# Altium schematic sheet P04_USB_hub.SchDoc
size A4
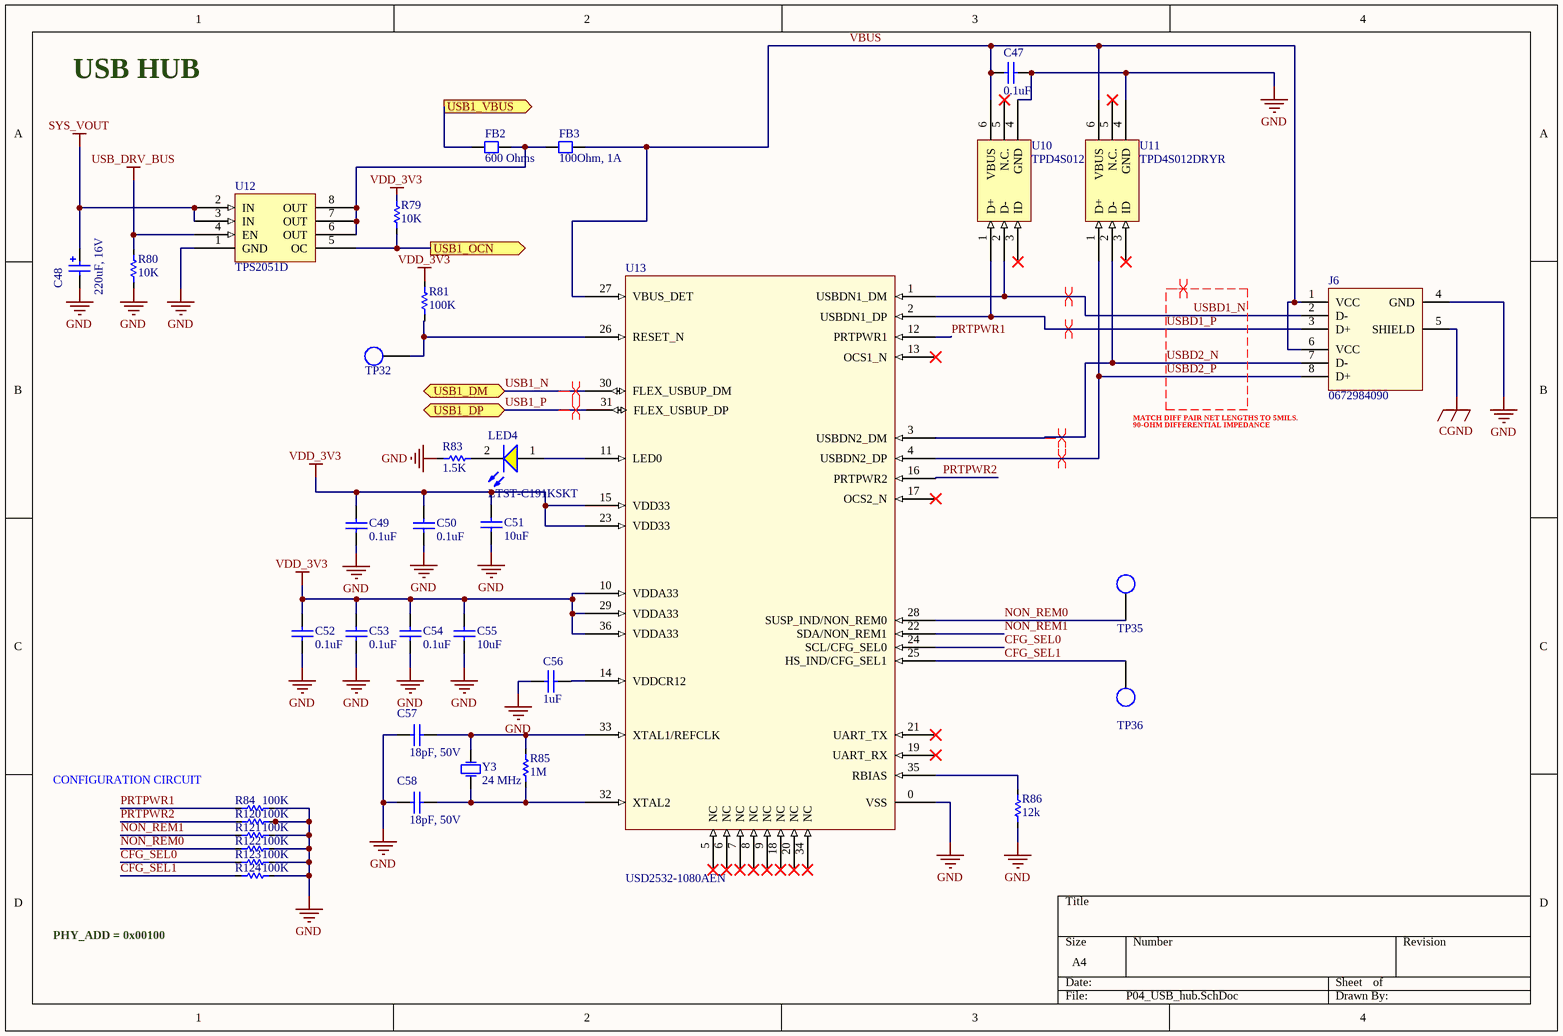
[diagram p0: P04_USB_hub.SchDoc]

## Parts
C47  0.1uF  [CAP_0603]
C48  220uF, 16V  [CAP_SMD_6.3x7.7]
C49  0.1uF  [CAP_0603]
C50  0.1uF  [CAP_0603]
C51  10uF  [CAP_0603]
C52  0.1uF  [CAP_0603]
C53  0.1uF  [CAP_0603]
C54  0.1uF  [CAP_0603]
C55  10uF  [CAP_0603]
C56  1uF  [CAP_0603]
C57  18pF, 50V  [CAP_0603]
C58  18pF, 50V  [CAP_0603]
FB2  600 Ohms  [CAP_0603]
FB3  100Ohm, 1A  [CAP_0603]
J6  0672984090  [Dual USB Connector Molex]
LED4  LTST-C191KSKT  [LED_0603]
R79  10K  [RES_0603]
R80  10K  [RES_0603]
R81  100K  [RES_0603]
R83  1.5K  [RES_0603]
R84  100K  [RES_0603]
R85  1M  [RES_0603]
R86  12k  [RES_0603]
R120  100K  [RES_0603]
R121  100K  [RES_0603]
R122  100K  [RES_0603]
R123  100K  [RES_0603]
R124  100K  [RES_0603]
TP32  TP_SMD  [TP_SMD]  (value not drawn)
TP35  TP_SMD  [TP_SMD]  (value not drawn)
TP36  TP_SMD  [TP_SMD]  (value not drawn)
U10  TPD4S012DRYR  [SON50P100X60-6N]
U11  TPD4S012DRYR  [SON50P100X60-6N]
U12  TPS2051D  [SOIC127P600X175-8N]
U13  USD2532-1080AEN  [DUAL_USB_HUB]
Y3  24 MHz  [7A-24MHz]

## Ports
USB1_DM (bidir), USB1_DP (bidir), USB1_OCN (out), USB1_VBUS (out)

## Nets
CGND: J6.5(SHIELD)
GND: C47.2 C48.1(N) C49.1 C50.1 C51.1 C52.1 C53.1 C54.1 C55.1 C56.1 C57.1(N) C58.1(N) J6.4(GND) R80.1 R83.1 R84.2 R86.1 R120.2 R121.2 R122.2 R123.2 R124.2 U10.4(GND) U11.4(GND) U12.1(GND) U13.0(VSS)
SYS_VOUT: C48.2(P) U12.2(IN) U12.3(IN)
USB_DRV_BUS: R80.2 U12.4(EN)
VDD_3V3: C49.2 C50.2 C51.2 C52.2 C53.2 C54.2 C55.2 R79.2 R81.2 U13.10(VDDA33) U13.15(VDD33) U13.23(VDD33) U13.29(VDDA33) U13.36(VDDA33)
CFG_SEL0: R123.1 U13.24(SCL/CFG_SEL0)
CFG_SEL1: R124.1 TP36.1 U13.25(HS_IND/CFG_SEL1)
NON_REM0: R122.1 TP35.1 U13.28(SUSP_IND/NON_REM0)
NON_REM1: R121.1 U13.22(SDA/NON_REM1)
PRTPWR1: R84.1 U13.12(PRTPWR1)
PRTPWR2: R120.1 U13.16(PRTPWR2)
USB1_N: U13.30(FLEX_USBUP_DM) ; port USB1_DM
USB1_OCN: R79.1 U12.5(OC) ; port USB1_OCN
USB1_P: U13.31(FLEX_USBUP_DP) ; port USB1_DP
USB1_VBUS: FB2.1 ; port USB1_VBUS
USBD1_N: J6.2(D-) U10.2(D-) U13.1(USBDN1_DM)
USBD1_P: J6.3(D+) U10.1(D+) U13.2(USBDN1_DP)
USBD2_N: J6.7(D-) U11.2(D-) U13.3(USBDN2_DM)
USBD2_P: J6.8(D+) U11.1(D+) U13.4(USBDN2_DP)
VBUS: C47.1 FB3.2 J6.1(VCC) J6.6(VCC) U10.6(VBUS) U11.6(VBUS) U13.27(VBUS_DET)
NetC56_2: C56.2 U13.14(VDDCR12)
NetC57_2: C57.2(P) R85.2 U13.33(XTAL1/REFCLK) Y3.2(OSC2)
NetC58_2: C58.2(P) R85.1 U13.32(XTAL2) Y3.1(OSC1)
NetFB2_2: FB2.2 FB3.1 U12.6(OUT) U12.7(OUT) U12.8(OUT)
NetLED4_1: LED4.1(A) U13.11(LED0)
NetLED4_2: LED4.2(C) R83.2
NetR81_1: R81.1 TP32.1 U13.26(RESET_N)
NetR86_2: R86.2 U13.35(RBIAS)

Not connected (* = marked no-connect by the designer): U10 3(ID)* 5(N.C.)*; U11 3(ID)* 5(N.C.)*; U13 5(NC)* 6(NC)* 7(NC)* 8(NC)* 9(NC)* 13(OCS1_N)* 17(OCS2_N)* 18(NC)* 19(UART_RX)* 20(NC)* 21(UART_TX)* 34(NC)*

## Layout directives
differential pair; net class Z90_DIFF: USBD1_N, USBD1_P, USBD2_N, USBD2_P
differential pair: USBD1_N, USBD1_P, USBD2_N, USBD2_P
differential pair; differential pair class USB: USB1_N, USB1_P

## Notes on the sheet
- USB HUB
- MATCH DIFF PAIR NET LENGTHS TO 5MILS.
- 90-OHM DIFFERENTIAL IMPEDANCE
- CONFIGURATION CIRCUIT
- PHY_ADD = 0x00100

## Library data of the parts
C47 C49 C50 C52-C54 = C0603C104M4RACTU: CAP CER 0.1UF 16V X7R 0603; Manufacturer: KEMET; Tolerance: 20%; ComponentLink1Description: Manufacturer; ComponentLink1URL: http://www.we-online.de; Value: 0.1uF; Rated Voltage: 16V; Ceramic Type: X7R; Supplier Part No.: 399-1099-1-ND; Package Reference: CAP_0603; Package Description: 0603; Mounting Technology: SMD; Manufacturer Part No.: C0603C104M4RACTU; Datasheet: https://content.kemet.com/datasheets/KEM_C1002_X7R_SMD.pdf; Supplier: Digi-Key; ComponentLink2Description: Datasheet; ComponentLink2URL: https://content.kemet.com/datasheets/KEM_C1002_X7R_SMD.pdf
C48 = 865080345012: CAP 220 UF 20% 16 V; Manufacturer: Wurth Elektronik; Rated Voltage: 16 VDC; ComponentLink1Description: Manufacturer; ComponentLink1URL: http://www.we-online.de; ComponentLink2Description: Datasheet; ComponentLink2URL: https://katalog.we-online.com/pbs/datasheet/865080345012.pdf; Mounting Technology: SMD; Value: 220uF; Manufacturer Part No.: 865080345012; Tolerance: 20%; Datasheet: *; Supplier: Digi-Key; Package Reference: CAP_SMD_6.3x7.7; Supplier Part No.: 732-8422-1-ND; Package Description: CAP_SMD_6.3x7.7
C51 C55 = C0603C106M8PAC7867: CAP CER 10UF 10V X5R 0603; Manufacturer: KEMET; Ceramic Type: X7R; Tolerance: 20%; ComponentLink1Description: Manufacturer; ComponentLink1URL: http://www.we-online.de; Value: 10uF; Rated Voltage: 10V; Supplier Part No.: 399-14945-1-ND; Package Reference: CAP_0603; Package Description: 0603; Mounting Technology: SMD; Manufacturer Part No.: C0603C106M8PAC7867; Datasheet: https://content.kemet.com/datasheets/KEM_C1002_X7R_SMD.pdf; Supplier: Digi-Key; ComponentLink2Description: Datasheet; ComponentLink2URL: https://content.kemet.com/datasheets/KEM_C1002_X7R_SMD.pdf
C56 = C0603C105M4RACTU: CAP CER 1UF 16V X7R 0603; Manufacturer: KEMET; Tolerance: 20%; ComponentLink1Description: Manufacturer; ComponentLink1URL: http://www.we-online.de; Value: 1uF; Rated Voltage: 16V; Ceramic Type: X7R; Supplier Part No.: 399-11136-1-ND; Package Reference: CAP_0603; Package Description: 0603; Mounting Technology: SMD; Manufacturer Part No.: C0603C105M4RACTU; Datasheet: https://content.kemet.com/datasheets/KEM_C1002_X7R_SMD.pdf; Supplier: Digi-Key; ComponentLink2Description: Datasheet; ComponentLink2URL: https://content.kemet.com/datasheets/KEM_C1002_X7R_SMD.pdf
C57 C58 = C0603C180D5GACTU: CAP CER 18PF 50V C0G/NP0 0603 +/- 0.5 PF; Manufacturer: KEMET; Tolerance: 0.5 pF; Rated Voltage: 50 VDC; ComponentLink1Description: Manufacturer; ComponentLink1URL: http://www.we-online.de; ComponentLink2Description: Datasheet; ComponentLink2URL: https://katalog.we-online.com/pbs/datasheet/865080345012.pdf; Mounting Technology: SMD; Value: 18 pF; Manufacturer Part No.: C0603C180D5GACTU; Datasheet: *; Supplier: Digi-Key; Package Reference: CAP_0603; Supplier Part No.: 399-9018-1-ND; Package Description: 0603
FB2 = BBHV00160808601Y00: 600 Ohms @ 100MHz Ferrite Bead 0603 2A 100mOhm; Manufacturer: Chilisin Electronics; ComponentLink1Description: Manufacturer; ComponentLink1URL: http://www.we-online.de; Value: 600 Ohms; Rated Current: 2 A; Supplier Part No.: 2184-BBHV00160808601Y00CT-ND; Package Reference: FB_0603; Package Description: 0603; Mounting Technology: SMD; Manufacturer Part No.: BBHV00160808601Y00; Datasheet: https://www.chilisin.com/upload/media/product/emi_bead/file/BBHV_Series.pdf; Tolerance: -; Supplier: Digi-Key; ComponentLink2Description: Datasheet; ComponentLink2URL: https://content.kemet.com/datasheets/KEM_C1002_X7R_SMD.pdf
FB3 = MPZ1608D101BTA00: FERRITE BEAD 100 OHM 0603 1LN; Manufacturer: TDK Corporation; Datasheet: https://product.tdk.com/info/en/catalog/datasheets/beads_commercial_power_mpz1608_en.pdf; Manufacturer Part No.: MPZ1608D101BTA00; Supplier: Digi-Key; Package Description: 100 Ohms @ 100MHz 1 Power Line Ferrite Bead 0603 (1608 Metric) 1A 150mOhm; Supplier Part No.: 445-2988-1-ND; Package Reference: CAP_0603; Mounting Technology: SMD
J6 = 0672984090: CONN RCPT TYPEA STACKED 8POS R/A; Manufacturer: Molex; ComponentLink1 Description: Manufacturer; ComponentLink2 Description: Datasheet; ComponentLink1URL: http://www.we-online.de; ComponentLink2URL: http://katalog.we-online.de/em/datasheet/629105150521.pdf; Supplier: Digikey; Mounting Technology: THRU/SMD; Supplier Part No.: WM17130-ND; Package Description: CONN RCPT TYPEA STACKED 8POS R/A; Manufacturer Part No.: 0672984090; Package Reference: 0672984090; Datasheet: https://www.molex.com/pdm_docs/sd/672984090_sd.pdf
LED4 = LTST-C191KSKT: LED YELLOW CLEAR SMD 0603; Manufacturer: Lite-On Inc.; Vf: 2.1V; Test Current: 20 mA; ComponentLink1Description: Manufacturer; ComponentLink1URL: http://www.we-online.de; ComponentLink2Description: Datasheet; ComponentLink2URL: http://katalog.we-online.com/led/datasheet/150080BS75000.pdf; Color: Yellow; Manufacturer Part No.: LTST-C191KSKT; Supplier: Digi-Key; Package Reference: LED_0603; Supplier Part No.: 160-1448-1-ND; Mounting Technology: SMD; Datasheet: http://optoelectronics.liteon.com/upload/download/DS22-2000-224/LTST-C191KSKT.PDF
R79 R80 = RC0603FR-0710KL: RES SMD 10K OHM 1% 1/10W 0603; Manufacturer: Yageo; Tolerance: 1%; Manufacturer Part No.: RC0603FR-0710KL; Date: 2020; ComponentLink1Description: Manufacturer Link; ComponentLink1URL: http://www.vishay.com/company/brands/dale/; ComponentLink2Description: Datasheet; ComponentLink2URL: http://www.vishay.com/docs/20035/dcrcwe3.pdf; Supplier: Digikey; Supplier Part No.: 311-10.0KHRCT-ND; Datasheet: https://www.yageo.com/upload/media/product/productsearch/datasheet/rchip/PYu-RC_Group_51_RoHS_L_10.pdf; Package Reference: RES_0603; Package Description: 0603; Mounting Technology: SMD; Value: 10K; Power Rating: 1/10W
R81 R84 R120-R124 = RC0603FR-07100KL: RES SMD 100K OHM 1% 1/10W 0603; Manufacturer: Yageo; Tolerance: 1%; Manufacturer Part No.: RC0603FR-07100KL; Date: 2020; ComponentLink1Description: Manufacturer Link; ComponentLink1URL: http://www.vishay.com/company/brands/dale/; ComponentLink2Description: Datasheet; ComponentLink2URL: http://www.vishay.com/docs/20035/dcrcwe3.pdf; Supplier: Digikey; Supplier Part No.: 311-100KHRCT-ND; Datasheet: https://www.yageo.com/upload/media/product/productsearch/datasheet/rchip/PYu-RC_Group_51_RoHS_L_10.pdf; Package Reference: RES_0603; Package Description: 0603; Mounting Technology: SMD; Value: 100K; Power Rating: 1/10W
R83 = RC0603FR-071K5L: RES SMD 1.5K OHM 1% 1/10W 0603; Manufacturer: Yageo; Tolerance: 1%; Manufacturer Part No.: RC0603FR-071K5L; Date: 2020; ComponentLink1Description: Manufacturer Link; ComponentLink1URL: http://www.vishay.com/company/brands/dale/; ComponentLink2Description: Datasheet; ComponentLink2URL: http://www.vishay.com/docs/20035/dcrcwe3.pdf; Supplier: Digikey; Supplier Part No.: 311-1.50KHRCT-ND; Datasheet: https://www.yageo.com/upload/media/product/productsearch/datasheet/rchip/PYu-RC_Group_51_RoHS_L_10.pdf; Package Reference: RES_0603; Package Description: 0603; Mounting Technology: SMD; Value: 1.5K; Power Rating: 1/10W
R85 = RC0603JR-071ML: RES SMD 1M OHM 5% 1/10W 0603; Manufacturer: Yageo; Tolerance: 5%; Manufacturer Part No.: RC0603JR-071ML; Date: 2020; ComponentLink1Description: Manufacturer Link; ComponentLink1URL: http://www.vishay.com/company/brands/dale/; ComponentLink2Description: Datasheet; ComponentLink2URL: http://www.vishay.com/docs/20035/dcrcwe3.pdf; Supplier: Digikey; Supplier Part No.: 311-1.0MGRCT-ND; Datasheet: https://www.yageo.com/upload/media/product/productsearch/datasheet/rchip/PYu-RC_Group_51_RoHS_L_10.pdf; Package Reference: RES_0603; Package Description: 0603; Mounting Technology: SMD; Value: 1M; Power Rating: 1/10W
R86 = RMCF0603FT12K0: RES 12K OHM 1% 1/10W 0603; Manufacturer: Stackpole Electronics Inc; Tolerance: 1%; Manufacturer Part No.: RMCF0603FT12K0; Date: 2020; ComponentLink1Description: Manufacturer Link; ComponentLink1URL: http://www.vishay.com/company/brands/dale/; ComponentLink2Description: Datasheet; ComponentLink2URL: http://www.vishay.com/docs/20035/dcrcwe3.pdf; Supplier: Digikey; Supplier Part No.: RMCF0603FT12K0CT-ND; Datasheet: https://www.seielect.com/catalog/sei-rmcf_rmcp.pdf; Package Reference: RES_0603; Package Description: 0603; Mounting Technology: SMD; Power Rating: 1/10W; Value: 12k
U10 U11 = TPD4S012DRYR: TVS DIODE 5.5V 6SON; Manufacturer: Texas Instruments; Manufacturer Part No.: TPD4S012DRYR; ComponentLink1Description: Manufacturer Link; ComponentLink1URL: http://www.vishay.com/company/brands/dale/; ComponentLink2Description: Datasheet; ComponentLink2URL: http://www.vishay.com/docs/20035/dcrcwe3.pdf; Supplier: Digikey; Supplier Part No.: 296-24244-1-ND; Datasheet: http://www.ti.com/general/docs/suppproductinfo.tsp?distId=10&gotoUrl=http%3A%2F%2Fwww.ti.com%2Flit%2Fgpn%2Ftpd4s012; Package Reference: 6SON; Package Description: SON; Mounting Technology: SMD
U12 = TPS2051D: IC PWR SWITCH N-CHAN 1:1 8SOIC; Manufacturer: Texas Instruments; Manufacturer Part No.: TPS2051D; ComponentLink1Description: Manufacturer Link; ComponentLink1URL: http://www.vishay.com/company/brands/dale/; ComponentLink2Description: Datasheet; ComponentLink2URL: http://www.vishay.com/docs/20035/dcrcwe3.pdf; Supplier: Digikey; Supplier Part No.: 296-2576-5-ND; Datasheet: http://www.ti.com/lit/pdf/slvs172; Package Reference: 8-SOIC; Package Description: SOIC; Mounting Technology: SMD
U13 = USD2532-1080AEN: IC USB 2.0 HUB CTLR 2PORT 36SQFN; Manufacturer: Microchip Technology; Manufacturer Part No.: USB2532-1080AEN; ComponentLink1Description: Manufacturer Link; ComponentLink1URL: http://www.vishay.com/company/brands/dale/; ComponentLink2Description: Datasheet; ComponentLink2URL: http://www.vishay.com/docs/20035/dcrcwe3.pdf; Supplier: Digikey; Supplier Part No.: USB2532-1080AEN-ND; Datasheet: http://www.microchip.com/mymicrochip/filehandler.aspx?ddocname=en567006; Package Reference: 36SQFN; Package Description: QFN; Mounting Technology: SMD
Y3 = 7A-24.000MAAJ-T: CRYSTAL 24.0000MHZ 18PF SMD; Manufacturer: TXC CORPORATION; Date: 2020; ComponentLink1Description: Manufacturer Link; ComponentLink1URL: http://www.ecsxtal.com/; ComponentLink2Description: Data Sheet; Supplier Part No.: 887-1090-1-ND; Supplier: Digikey; Package Reference: 7A-24MHz; Package Description: 7A-24MHz; Mounting Technology: SMD; Manufacturer Part No.: 7A-24.000MAAJ-T; Datasheet: CRYSTAL 24.0000MHZ 18PF SMD; Value: 24 MHz